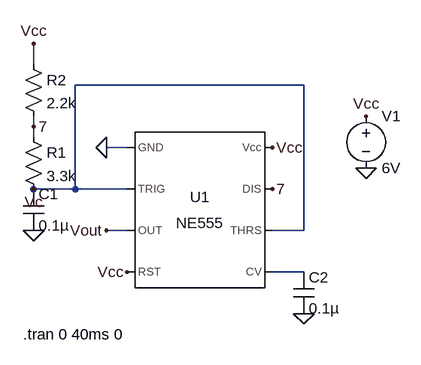
[diagram p0: schematic Astable_Multivibrator_with_NE555.asc]
Astable_Multivibrator_with_NE555.asc, the LTspice schematic file:
Version 4.1
SHEET 1 880 680
WIRE -32 -32 -32 -64
WIRE 384 0 32 0
WIRE -32 64 -32 48
WIRE -32 80 -32 64
WIRE 112 96 80 96
WIRE 32 160 32 0
WIRE 32 160 -32 160
WIRE 112 160 32 160
WIRE 112 224 80 224
WIRE 384 224 384 0
WIRE 384 224 336 224
WIRE 384 288 336 288
FLAG 80 96 0
FLAG -32 224 0
FLAG 480 128 0
FLAG 480 48 Vcc
FLAG 336 96 Vcc
FLAG -32 -64 Vcc
FLAG 112 288 Vcc
FLAG 80 224 Vout
FLAG 384 352 0
FLAG 336 160 7
FLAG -32 64 7
FLAG -32 160 Vc
SYMBOL Misc\\NE555 224 192 R0
SYMATTR InstName U1
SYMBOL cap -48 160 R0
SYMATTR InstName C1
SYMATTR Value 0.1µ
SYMBOL res -48 64 R0
SYMATTR InstName R1
SYMATTR Value 3.3k
SYMBOL res -48 -48 R0
SYMATTR InstName R2
SYMATTR Value 2.2k
SYMBOL voltage 480 32 R0
WINDOW 123 0 0 Left 0
WINDOW 39 0 0 Left 0
SYMATTR InstName V1
SYMATTR Value 6V
SYMBOL cap 368 288 R0
SYMATTR InstName C2
SYMATTR Value 0.1µ
TEXT -48 384 Left 2 !.tran 0 40ms 0

The netlist it stands for:
* Astable_Multivibrator_with_NE555.asc
X§U1 0 Vc Vout Vcc N001 Vc 7 Vcc NE555  ; pins GND TRIG OUT RST CV THRS DIS Vcc
C1 Vc 0 0.1µ
R1 7 Vc 3.3k
R2 Vcc 7 2.2k
V1 Vcc 0 6V
C2 N001 0 0.1µ
.tran 0 40ms 0
.lib NE555.sub
.backanno
.end